# Altium schematic sheet LightSensorsButtons.SchDoc
size A
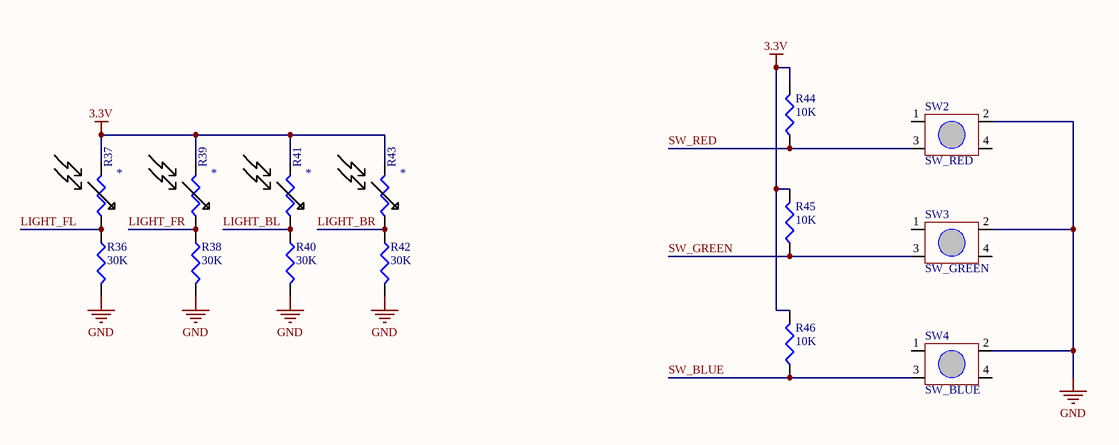
[diagram p0: LightSensorsButtons.SchDoc]

## Parts
R36  value 30K  [RESC1608L]  (hidden comment: Res3)
R37  photoresistor  [photoresistor]  (value not drawn)
R38  value 30K  [RESC1608L]  (hidden comment: Res3)
R39  photoresistor  [photoresistor]  (value not drawn)
R40  value 30K  [RESC1608L]  (hidden comment: Res3)
R41  photoresistor  [photoresistor]  (value not drawn)
R42  value 30K  [RESC1608L]  (hidden comment: Res3)
R43  photoresistor  [photoresistor]  (value not drawn)
R44  value 10K  [RESC1608L]  (hidden comment: Res3)
R45  value 10K  [RESC1608L]  (hidden comment: Res3)
R46  value 10K  [RESC1608L]  (hidden comment: Res3)
SW2  SW_RED  [SwitchTall-TL330]
SW3  SW_GREEN  [SwitchTall-TL330]
SW4  SW_BLUE  [SwitchTall-TL330]

## Nets
3.3V: R37.2 R39.2 R41.2 R43.2 R44.2 R45.2 R46.2
GND: R36.2 R38.2 R40.2 R42.2 SW2.2 SW3.2 SW4.2
LIGHT_BL: R40.1 R41.1
LIGHT_BR: R42.1 R43.1
LIGHT_FL: R36.1 R37.1
LIGHT_FR: R38.1 R39.1
SW_BLUE: R46.1 SW4.3
SW_GREEN: R45.1 SW3.3
SW_RED: R44.1 SW2.3

Not connected (* = marked no-connect by the designer): SW2 1 4; SW3 1 4; SW4 1 4

## Library data of the parts
R36 R38 R40 R42 R44-R46 = Res3: Resistor; Published: 8-Jun-2000; LatestRevisionDate: 29-May-2009; LatestRevisionNote: IPC-7351 Footprint Added.; PackageReference: J1-0603; Publisher: Altium Limited; PackageDescription: Chip Resistor
SW2-SW4 = Switch-TL330
R37 R39 R41 R43 = photoresistor: Value: *